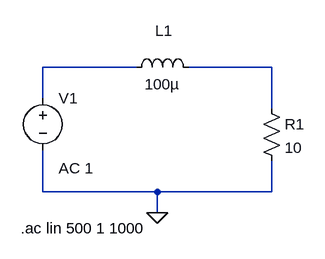
[diagram p0: schematic LR.asc]
LR.asc, the LTspice schematic file:
Version 4
SHEET 1 880 680
WIRE 96 64 -48 64
WIRE 304 64 176 64
WIRE -48 112 -48 64
WIRE 304 128 304 64
WIRE -48 256 -48 192
WIRE 128 256 -48 256
WIRE 304 256 304 208
WIRE 304 256 128 256
WIRE 128 288 128 256
FLAG 128 288 0
SYMBOL voltage -48 96 R0
WINDOW 123 24 124 Left 2
WINDOW 39 0 0 Left 0
SYMATTR InstName V1
SYMATTR Value ""
SYMATTR Value2 AC 1
SYMBOL ind 80 80 R270
WINDOW 0 56 58 VTop 2
WINDOW 3 5 56 VBottom 2
SYMATTR InstName L1
SYMATTR Value 100µ
SYMBOL res 288 112 R0
SYMATTR InstName R1
SYMATTR Value 10
TEXT -82 312 Left 2 !.ac lin 500 1 1000

The netlist it stands for:
* LR.asc
V1 N001 0 AC 1
L1 N001 N002 100µ
R1 N002 0 10
.ac lin 500 1 1000
.backanno
.end